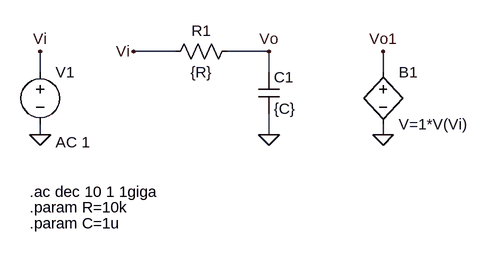
[diagram p0: schematic filtroPasaBajas.asc]
filtroPasaBajas.asc, the LTspice schematic file:
Version 4
SHEET 1 1444 784
WIRE 368 80 304 80
WIRE 512 80 448 80
WIRE 160 112 160 80
WIRE 512 112 512 80
WIRE 688 112 688 80
WIRE 160 208 160 192
WIRE 512 208 512 176
WIRE 688 208 688 192
FLAG 512 208 0
FLAG 688 208 0
FLAG 512 80 Vo
FLAG 304 80 Vi
FLAG 160 208 0
FLAG 160 80 Vi
FLAG 688 80 Vo1
SYMBOL res 464 64 R90
WINDOW 0 0 56 VBottom 2
WINDOW 3 32 56 VTop 2
SYMATTR InstName R1
SYMATTR Value {R}
SYMBOL cap 496 112 R0
SYMATTR InstName C1
SYMATTR Value {C}
SYMBOL bv 688 96 R0
SYMATTR InstName B1
SYMATTR Value V=1*V(Vi)
SYMATTR Value2 laplace=(1/({R}*{C}))/(s+1/({R}*{C}))
SYMBOL voltage 160 96 R0
WINDOW 123 24 124 Left 2
WINDOW 39 0 0 Left 0
SYMATTR Value2 AC 1
SYMATTR InstName V1
SYMATTR Value ""
TEXT 144 296 Left 2 !.ac dec 10 1 1giga
TEXT 144 320 Left 2 !.param R=10k
TEXT 144 344 Left 2 !.param C=1u

The netlist it stands for:
* filtroPasaBajas.asc
R1 Vo Vi {R}
C1 Vo 0 {C}
B1 Vo1 0 V=1*V(Vi) laplace=(1/({R}*{C}))/(s+1/({R}*{C}))
V1 Vi 0 AC 1
.ac dec 10 1 1giga
.param R=10k
.param C=1u
.backanno
.end